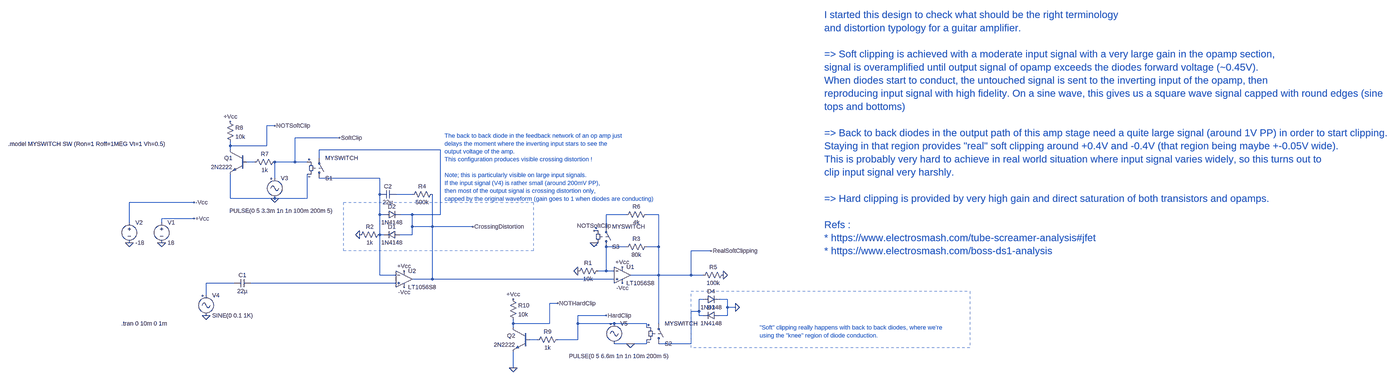
[diagram p0: schematic SoftClipAndCrossDist.asc, whole sheet]
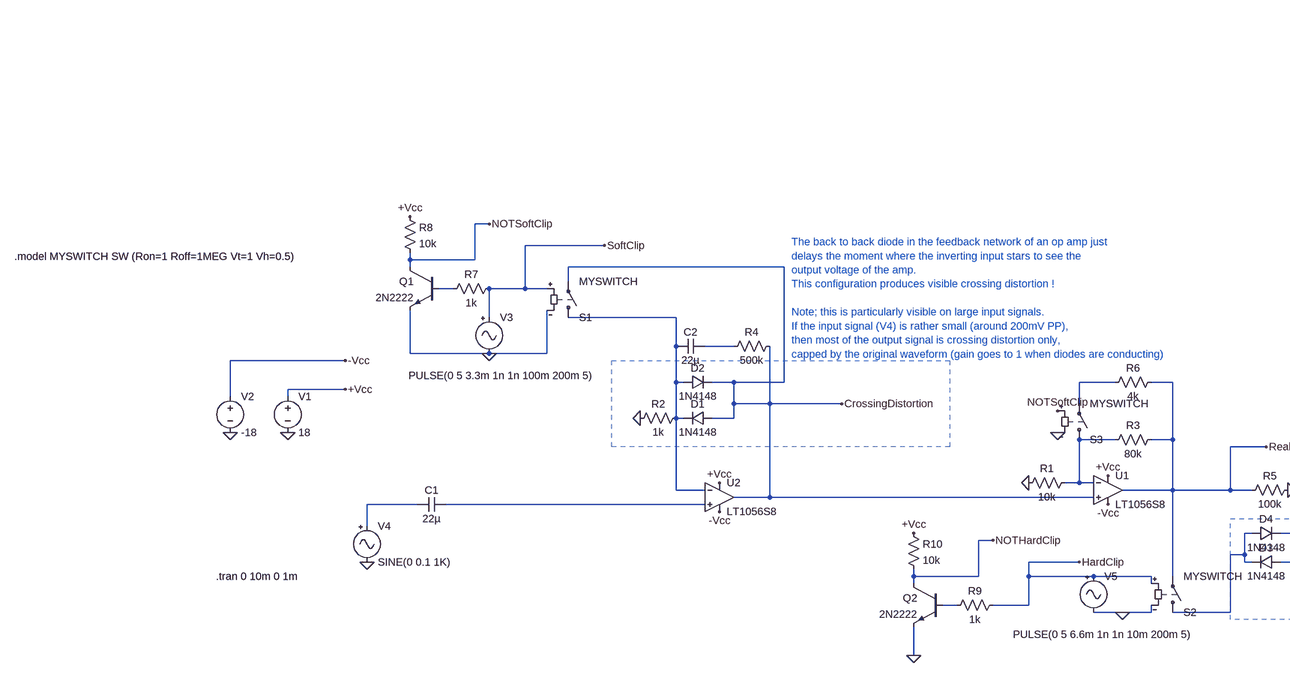
[diagram p1: schematic SoftClipAndCrossDist.asc, part, row 1 of 1, column 1 of 2]
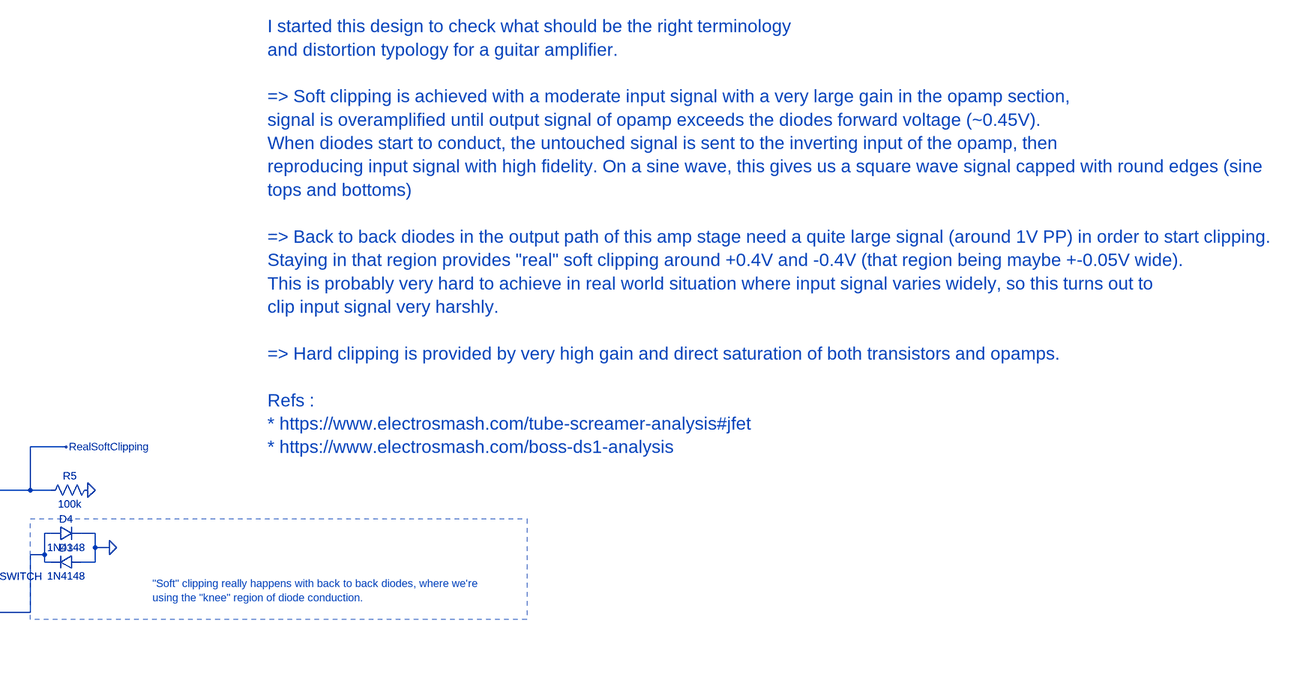
[diagram p2: schematic SoftClipAndCrossDist.asc, part, row 1 of 1, column 2 of 2]
SoftClipAndCrossDist.asc, the LTspice schematic file:
Version 4
SHEET 1 4652 680
WIRE 16 -448 -16 -448
WIRE 272 -400 96 -400
WIRE -160 -368 -160 -384
WIRE -16 -368 -16 -448
WIRE -16 -368 -160 -368
WIRE -160 -352 -160 -368
WIRE 672 -352 192 -352
WIRE 192 -320 192 -352
WIRE -64 -304 -96 -304
WIRE 96 -304 96 -400
WIRE 96 -304 16 -304
WIRE 144 -304 96 -304
WIRE 16 -240 16 -304
WIRE 432 -240 192 -240
WIRE 432 -176 432 -240
WIRE 448 -176 432 -176
WIRE 560 -176 496 -176
WIRE -160 -160 -160 -256
WIRE 16 -160 -160 -160
WIRE 144 -160 144 -256
WIRE 144 -160 16 -160
WIRE -304 -144 -560 -144
WIRE 432 -96 432 -176
WIRE 448 -96 432 -96
WIRE 560 -96 512 -96
WIRE 672 -96 672 -352
WIRE 672 -96 560 -96
WIRE 1408 -96 1328 -96
WIRE 1536 -96 1488 -96
WIRE -304 -80 -432 -80
WIRE -560 -64 -560 -144
WIRE -432 -64 -432 -80
WIRE 560 -48 560 -96
WIRE 640 -48 640 -176
WIRE 640 -48 560 -48
WIRE 800 -48 640 -48
WIRE 1328 -48 1328 -96
WIRE 432 -16 432 -96
WIRE 448 -16 432 -16
WIRE 560 -16 560 -48
WIRE 560 -16 512 -16
WIRE 1408 32 1328 32
WIRE 1536 32 1536 -96
WIRE 1536 32 1488 32
WIRE 1744 48 1664 48
WIRE 1328 128 1328 32
WIRE 1328 128 1296 128
WIRE 1360 128 1328 128
WIRE 432 144 432 -16
WIRE 496 144 432 144
WIRE 1536 144 1536 32
WIRE 1536 144 1424 144
WIRE 1664 144 1664 48
WIRE 1664 144 1536 144
WIRE 1712 144 1664 144
WIRE 640 160 640 -48
WIRE 640 160 560 160
WIRE 1360 160 640 160
WIRE -144 176 -256 176
WIRE 496 176 -80 176
WIRE -256 224 -256 176
WIRE 1712 240 1696 240
WIRE 1808 240 1776 240
WIRE 1136 256 1104 256
WIRE 1808 272 1808 240
WIRE 1840 272 1808 272
WIRE 1696 288 1696 240
WIRE 1696 288 1664 288
WIRE 1328 304 1216 304
WIRE 1696 304 1696 288
WIRE 1712 304 1696 304
WIRE 1808 304 1808 272
WIRE 1808 304 1776 304
WIRE 960 336 960 320
WIRE 1104 336 1104 256
WIRE 1104 336 960 336
WIRE 1216 336 1216 304
WIRE 1360 336 1216 336
WIRE 1488 336 1360 336
WIRE 1536 336 1536 144
WIRE 960 352 960 336
WIRE 1488 352 1488 336
WIRE 1056 400 1024 400
WIRE 1216 400 1216 336
WIRE 1216 400 1136 400
WIRE 1424 416 1360 416
WIRE 1488 416 1488 400
WIRE 1488 416 1424 416
WIRE 1664 416 1664 288
WIRE 1664 416 1536 416
WIRE 960 512 960 448
FLAG -560 16 0
FLAG -432 16 0
FLAG -304 -80 +Vcc
FLAG -304 -144 -Vcc
FLAG 528 128 +Vcc
FLAG 528 192 -Vcc
FLAG 16 -160 0
FLAG -256 304 0
FLAG 352 -16 0
FLAG 1840 272 0
FLAG 1792 144 0
FLAG 1744 48 RealSoftClipping
FLAG 800 -48 CrossingDistortion
FLAG 1424 416 0
FLAG 1392 112 +Vcc
FLAG 1392 176 -Vcc
FLAG 1216 128 0
FLAG 1280 16 0
FLAG -160 -464 +Vcc
FLAG 16 -448 NOTSoftClip
FLAG 272 -400 SoftClip
FLAG 960 240 +Vcc
FLAG 1136 256 NOTHardClip
FLAG 960 512 0
FLAG 1328 304 HardClip
FLAG 1280 -32 NOTSoftClip
SYMBOL cap -80 160 R90
WINDOW 0 0 32 VBottom 2
WINDOW 3 32 32 VTop 2
SYMATTR InstName C1
SYMATTR Value 22µ
SYMBOL voltage -432 -80 R0
WINDOW 123 0 0 Left 0
WINDOW 39 0 0 Left 0
SYMATTR InstName V1
SYMATTR Value 18
SYMBOL voltage -560 -80 R0
WINDOW 123 0 0 Left 0
WINDOW 39 0 0 Left 0
SYMATTR InstName V2
SYMATTR Value -18
SYMBOL diode 512 -32 R90
WINDOW 0 0 32 VBottom 2
WINDOW 3 32 32 VTop 2
SYMATTR InstName D1
SYMATTR Value 1N4148
SYMBOL diode 448 -80 R270
WINDOW 0 32 32 VTop 2
WINDOW 3 0 32 VBottom 2
SYMATTR InstName D2
SYMATTR Value 1N4148
SYMBOL sw 192 -224 M180
SYMATTR InstName S1
SYMATTR Value MYSWITCH
SYMBOL Misc\\signal 16 -256 R0
WINDOW 3 -179 145 Left 2
WINDOW 123 0 0 Left 0
WINDOW 39 0 0 Left 0
SYMATTR Value PULSE(0 5 3.3m 1n 1n 100m 200m 5)
SYMATTR InstName V3
SYMBOL Misc\\signal -256 208 R0
WINDOW 123 0 0 Left 0
WINDOW 39 0 0 Left 0
SYMATTR InstName V4
SYMATTR Value SINE(0 0.1 1K)
SYMBOL OpAmps\\LT1056S8 528 96 R0
SYMATTR InstName U2
SYMBOL res 448 -32 R90
WINDOW 0 0 56 VBottom 2
WINDOW 3 32 56 VTop 2
SYMATTR InstName R2
SYMATTR Value 1k
SYMBOL cap 496 -192 R90
WINDOW 0 0 32 VBottom 2
WINDOW 3 32 32 VTop 2
SYMATTR InstName C2
SYMATTR Value 22µ
SYMBOL res 656 -192 R90
WINDOW 0 0 56 VBottom 2
WINDOW 3 32 56 VTop 2
SYMATTR InstName R4
SYMATTR Value 500k
SYMBOL diode 1776 288 R90
WINDOW 0 0 32 VBottom 2
WINDOW 3 32 32 VTop 2
SYMATTR InstName D3
SYMATTR Value 1N4148
SYMBOL diode 1712 256 R270
WINDOW 0 32 32 VTop 2
WINDOW 3 0 32 VBottom 2
SYMATTR InstName D4
SYMATTR Value 1N4148
SYMBOL res 1808 128 R90
WINDOW 0 0 56 VBottom 2
WINDOW 3 32 56 VTop 2
SYMATTR InstName R5
SYMATTR Value 100k
SYMBOL sw 1536 432 M180
SYMATTR InstName S2
SYMATTR Value MYSWITCH
SYMBOL Misc\\signal 1360 320 R0
WINDOW 3 -179 145 Left 2
WINDOW 123 0 0 Left 0
WINDOW 39 0 0 Left 0
SYMATTR Value PULSE(0 5 6.6m 1n 1n 10m 200m 5)
SYMATTR InstName V5
SYMBOL OpAmps\\LT1056S8 1392 80 R0
SYMATTR InstName U1
SYMBOL res 1312 112 R90
WINDOW 0 0 56 VBottom 2
WINDOW 3 32 56 VTop 2
SYMATTR InstName R1
SYMATTR Value 10k
SYMBOL res 1504 16 R90
WINDOW 0 0 56 VBottom 2
WINDOW 3 32 56 VTop 2
SYMATTR InstName R3
SYMATTR Value 80k
SYMBOL sw 1328 48 M180
SYMATTR InstName S3
SYMATTR Value MYSWITCH
SYMBOL res 1504 -112 R90
WINDOW 0 0 56 VBottom 2
WINDOW 3 32 56 VTop 2
SYMATTR InstName R6
SYMATTR Value 4k
SYMBOL npn -96 -352 M0
SYMATTR InstName Q1
SYMATTR Value 2N2222
SYMBOL res 32 -320 R90
WINDOW 0 0 56 VBottom 2
WINDOW 3 32 56 VTop 2
SYMATTR InstName R7
SYMATTR Value 1k
SYMBOL res -176 -480 R0
SYMATTR InstName R8
SYMATTR Value 10k
SYMBOL npn 1024 352 M0
SYMATTR InstName Q2
SYMATTR Value 2N2222
SYMBOL res 1152 384 R90
WINDOW 0 0 56 VBottom 2
WINDOW 3 32 56 VTop 2
SYMATTR InstName R9
SYMATTR Value 1k
SYMBOL res 944 224 R0
SYMATTR InstName R10
SYMATTR Value 10k
TEXT -592 336 Left 2 !.tran 0 10m 0 1m
TEXT -1040 -376 Left 2 !.model MYSWITCH SW (Ron=1 Roff=1MEG Vt=1 Vh=0.5)
TEXT 1936 352 Left 2 ;"Soft" clipping really happens with back to back diodes, where we're\nusing the "knee" region of diode conduction.
TEXT 688 -408 Left 2 ;The back to back diode in the feedback network of an op amp just\ndelays the moment where the inverting input stars to see the \noutput voltage of the amp.\nThis configuration produces visible crossing distortion !\n \nNote; this is particularly visible on large input signals.\nIf the input signal (V4) is rather small (around 200mV PP), \nthen most of the output signal is crossing distortion only,\ncapped by the original waveform (gain goes to 1 when diodes are conducting)
TEXT 2192 -888 Left 4 ;I started this design to check what should be the right terminology\nand distortion typology for a guitar amplifier.\n \n=> Soft clipping is achieved with a moderate input signal with a very large gain in the opamp section, \nsignal is overamplified until output signal of opamp exceeds the diodes forward voltage (~0.45V).\nWhen diodes start to conduct, the untouched signal is sent to the inverting input of the opamp, then \nreproducing input signal with high fidelity. On a sine wave, this gives us a square wave signal capped with round edges (sine \ntops and bottoms)\n \n=> Back to back diodes in the output path of this amp stage need a quite large signal (around 1V PP) in order to start clipping.\nStaying in that region provides "real" soft clipping around +0.4V and -0.4V (that region being maybe +-0.05V wide).\nThis is probably very hard to achieve in real world situation where input signal varies widely, so this turns out to\nclip input signal very harshly.\n \n=> Hard clipping is provided by very high gain and direct saturation of both transistors and opamps.\n \nRefs :\n* https://www.electrosmash.com/tube-screamer-analysis#jfet\n* https://www.electrosmash.com/boss-ds1-analysis
RECTANGLE Normal 1040 48 288 -144 1
RECTANGLE Normal 2768 432 1664 208 1

The netlist it stands for:
* SoftClipAndCrossDist.asc
C1 N007 N006 22µ
V1 +Vcc 0 18
V2 -Vcc 0 -18
D1 CrossingDistortion N002 1N4148
D2 N002 CrossingDistortion 1N4148
S1 N002 CrossingDistortion SoftClip 0 MYSWITCH
V3 SoftClip 0 PULSE(0 5 3.3m 1n 1n 100m 200m 5)
V4 N006 0 SINE(0 0.1 1K)
XU2 N007 N002 +Vcc -Vcc CrossingDistortion LT1056S8  ; pins In+ In- V+ V- OUT
R2 N002 0 1k
C2 N003 N002 22µ
R4 CrossingDistortion N003 500k
D3 0 N008 1N4148
D4 N008 0 1N4148
R5 0 RealSoftClipping 100k
S2 N008 RealSoftClipping HardClip 0 MYSWITCH
V5 HardClip 0 PULSE(0 5 6.6m 1n 1n 10m 200m 5)
XU1 CrossingDistortion N005 +Vcc -Vcc RealSoftClipping LT1056S8  ; pins In+ In- V+ V- OUT
R1 N005 0 10k
R3 RealSoftClipping N005 80k
S3 N005 N004 NOTSoftClip 0 MYSWITCH
R6 RealSoftClipping N004 4k
Q1 NOTSoftClip N001 0 0 2N2222
R7 SoftClip N001 1k
R8 +Vcc NOTSoftClip 10k
Q2 NOTHardClip N009 0 0 2N2222
R9 HardClip N009 1k
R10 +Vcc NOTHardClip 10k
.model D D
.lib standard.dio
.model NPN NPN
.model PNP PNP
.lib standard.bjt
.tran 0 10m 0 1m
.model MYSWITCH SW (Ron=1 Roff=1MEG Vt=1 Vh=0.5)
* "Soft" clipping really happens with back to back diodes, where we're
* using the "knee" region of diode conduction.
* The back to back diode in the feedback network of an op amp just
* delays the moment where the inverting input stars to see the
* output voltage of the amp.
* This configuration produces visible crossing distortion !
* Note; this is particularly visible on large input signals.
* If the input signal (V4) is rather small (around 200mV PP),
* then most of the output signal is crossing distortion only,
* capped by the original waveform (gain goes to 1 when diodes are conducting)
* I started this design to check what should be the right terminology
* and distortion typology for a guitar amplifier.
* => Soft clipping is achieved with a moderate input signal with a very large gain in the opamp section,
* signal is overamplified until output signal of opamp exceeds the diodes forward voltage (~0.45V).
* When diodes start to conduct, the untouched signal is sent to the inverting input of the opamp, then
* reproducing input signal with high fidelity. On a sine wave, this gives us a square wave signal capped with round edges (sine
* tops and bottoms)
* => Back to back diodes in the output path of this amp stage need a quite large signal (around 1V PP) in order to start clipping.
* Staying in that region provides "real" soft clipping around +0.4V and -0.4V (that region being maybe +-0.05V wide).
* This is probably very hard to achieve in real world situation where input signal varies widely, so this turns out to
* clip input signal very harshly.
* => Hard clipping is provided by very high gain and direct saturation of both transistors and opamps.
* Refs :
* * https://www.electrosmash.com/tube-screamer-analysis#jfet
* * https://www.electrosmash.com/boss-ds1-analysis
.backanno
.end